# EAGLE design Nintendo DSi USB-C (EAGLE 6.2)
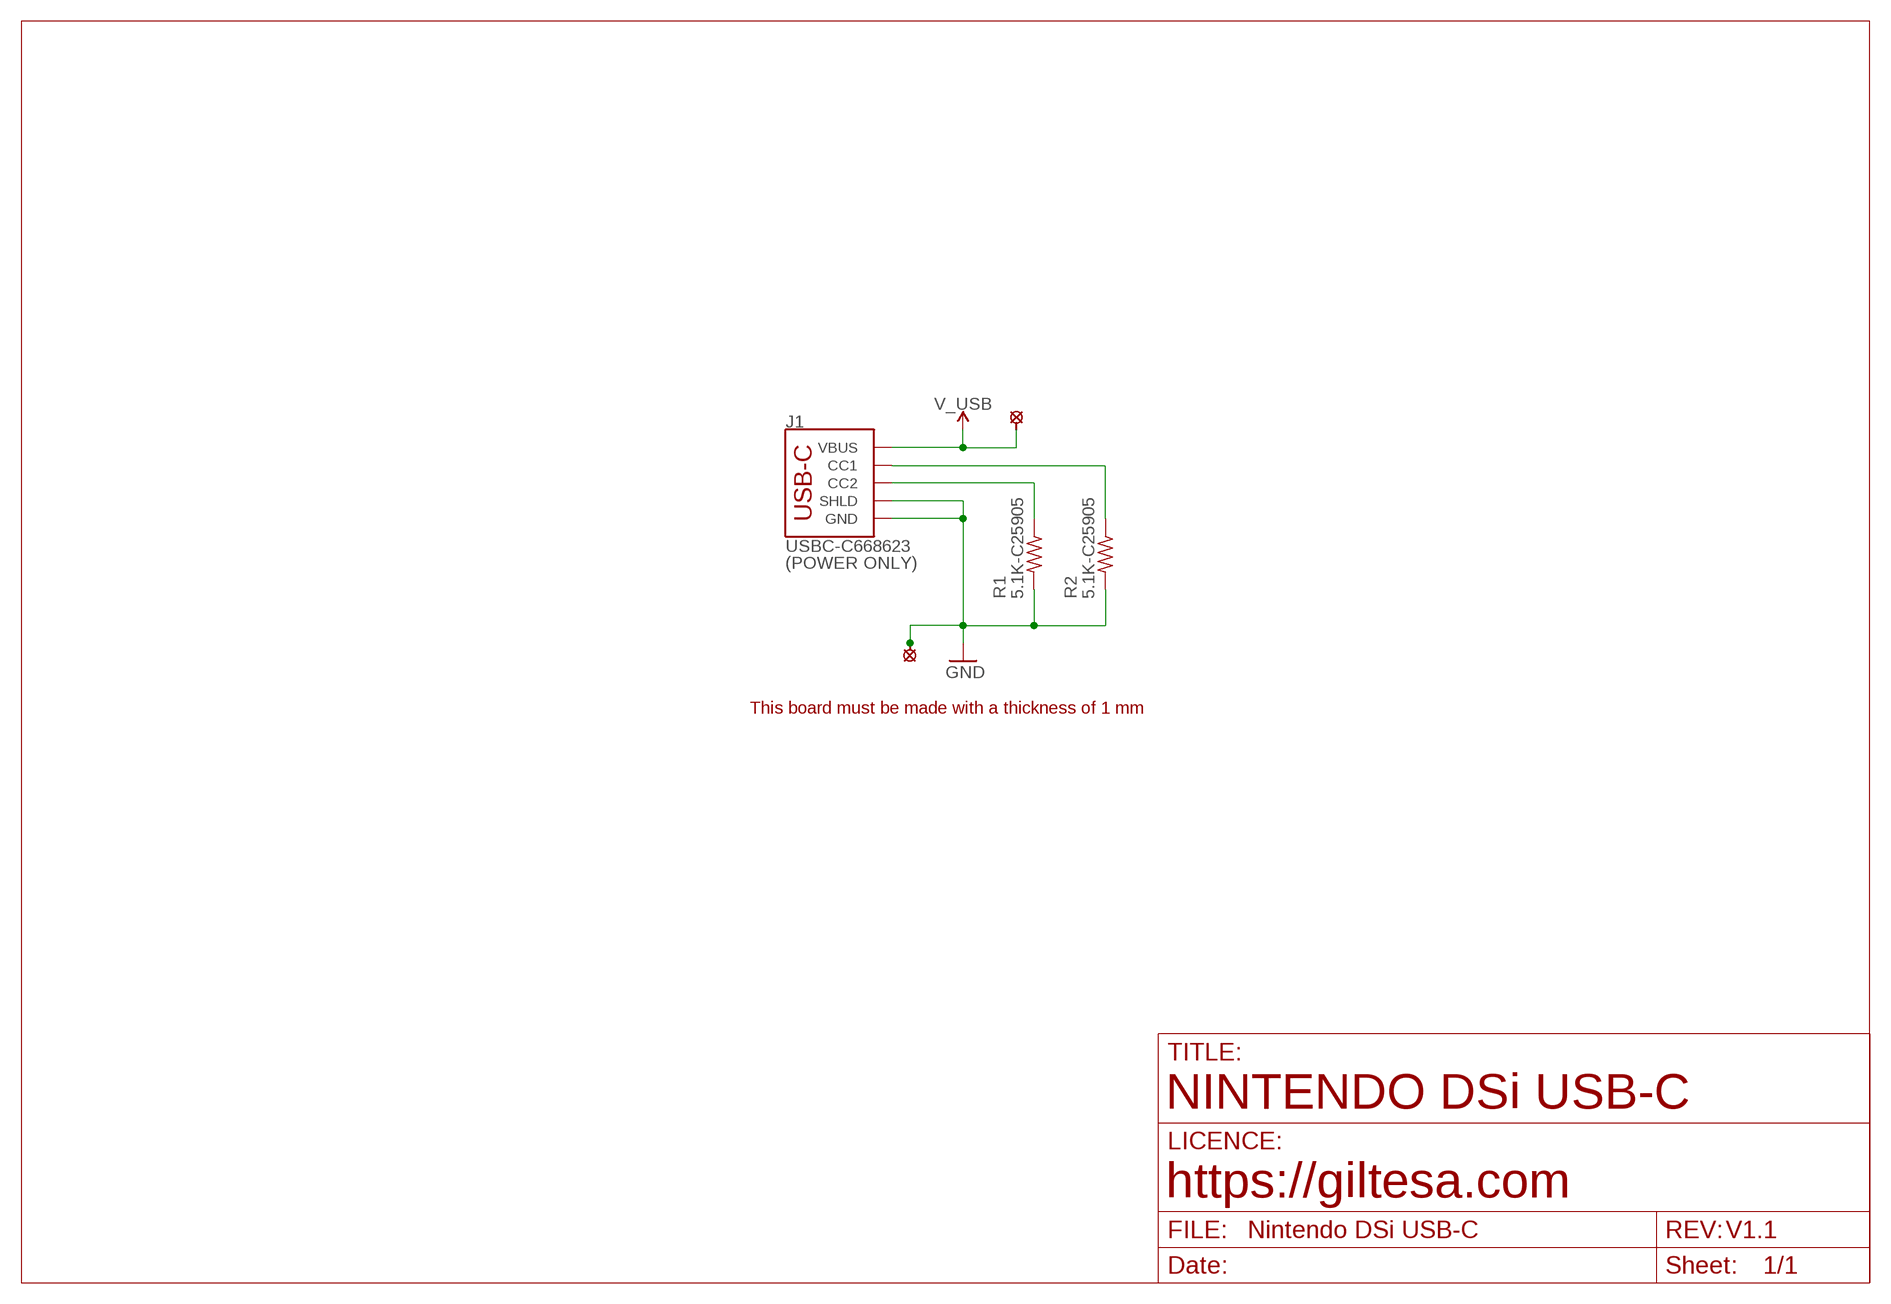
[diagram p0: schematic, sheet 1]

## Parts
J1  USBC-C668623  USB-C_6P_POWER  [USB-C_6P]
R1  5.1K-C25905  R0402  [R0402]
R2  5.1K-C25905  R0402  [R0402]
U$2  PAD_1.0H  [PAD_1.0_HALF_MASK]
U$3  PAD_1.0H  [PAD_1.0_HALF_MASK]
U$4  PAD_1.0H  [PAD_1.0_HALF_MASK]
U$5  PAD_1.0H  [PAD_1.0_HALF_MASK]

## Nets
GND: J1.A12-GND(GND) J1.B12-GND(GND) J1.SHLD1(SHLD) J1.SHLD2(SHLD) J1.SHLD3(SHLD) J1.SHLD4(SHLD) R1.2 R2.2 U$3.P$1 U$4.P$1 U$5.P$1
N$4: J1.B5(CC2) R1.1
N$13: J1.A5(CC1) R2.1
V_USB: J1.A9-VBUS(VBUS) J1.B9-VBUS(VBUS) U$2.P$1

## Notes on the sheet
- (POWER ONLY)
- This board must be made with a thickness of 1 mm
- NINTENDO DSi USB-C
- https://giltesa.com
- V1.1

## Library data of the parts
J1 = ,giltesa:USB-C_6P
R1 R2 = ,giltesa:R0402
U$2-U$5 = ,giltesa:PAD

## Net classes
1 power: width 0.61 mm, drill 0.406 mm, clearance 0.203 mm
2 gnd: width 0.305 mm, drill 0.406 mm, clearance 0.203 mm
3 power usb: width 0.508 mm, drill 0.406 mm, clearance 0.203 mm

## Board
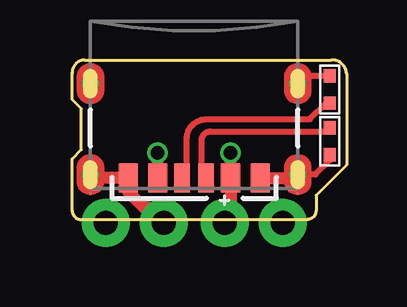
[diagram p1: board, top side]
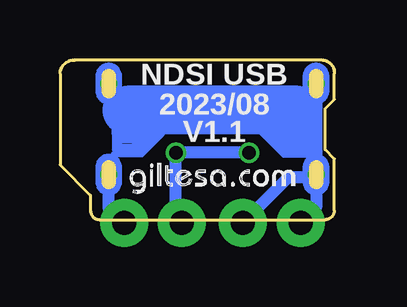
[diagram p2: board, bottom side, seen from below]

Size 11.43 x 6.67 mm. Coordinates in mm from the lower left corner, seen from the top.
Outline: 11.43,6.1 11.43,2.29 10.16,1.02 10.16,0.38 arc-90 9.78,0 0.38,0 arc-90 0,0.38 0,2.54 0.38,2.92 0.38,4.64 0,5.02 0,6.1 arc-90 0.51,6.67 10.8,6.67 arc-90 11.43,6.1
Copper layers (1*16): Top 0.035mm / dielectric 1.6mm / Bottom 0.035mm
Design rules: minimum track width 6mil, minimum drill 12mil, track to track 6mil, track to pad 6mil, pad to pad 6mil, via to via 8mil, smd to smd 0mil, copper to edge 20mil, drill to drill 10mil, minimum pad ring 6mil, minimum via ring 6mil, stop-mask expansion 0mil, vias tented up to drill 100mil, thermal gap 10mil

### Footprints (pad centres in the part's own frame; a part is rotated, then mirrored left to right if it is on the bottom)
USB-C_6P = smd 0.635 x 1.2: A5 -0.5,2.034; B5 0.5,2.034 | smd 0.8 x 1.2: A9-VBUS 1.52,2.034; A12-GND 2.75,2.034; B9-VBUS -1.52,2.034; B12-GND -2.75,2.034 | drill 0.4 pad 0.6: SHLD1 -4.318,1.9; SHLD2 4.32,1.9; SHLD3 -4.318,-1.9; SHLD4 4.32,-1.9
R0402 = smd 0.559 x 0.5: 1 -0.567,0; 2 0.567,0
PAD_1.0_HALF_MASK = drill 1 pad 2: P$1 0,0

### Placement (x,y rotation side)
J1  5.08,3.78 180 top
R1  10.73,5.43 90 top
R2  10.73,3.27 270 top
U$2  6.35,-0.13 0 top
U$3  1.4,-0.13 0 top
U$4  3.81,-0.13 0 top
U$5  8.76,-0.13 0 top
U$11  [GILTESA.COM_MASK_7MM]  8.56,1.02 0 bottom

### Tracks (layer width: path | path; a pad name or v marks a point on that pad's centre or on a via)
GND
  Top 0.254: R2.2 10.73,2.48 10.14,1.88 J1.SHLD1 9.27,1.75 | R1.2 9.72,6 J1.SHLD3
  Top 0.508: J1.SHLD2 0.89,1.75 J1.A12-GND 2.33,1.16 2.99,0.51 3.18,0.51 U$4.P$1 | J1.B12-GND 9.27,1.75
  Bottom 0.254: 0.89,2.79 1.91,2.79 2.67,3.56 1.14,3.56 1.02,3.68 1.02,2.92 | 1.02,2.92 1.78,2.92 2.29,3.43 1.14,3.43 1.14,3.05 1.78,3.05 1.78,3.17 1.91,3.3 1.27,3.3 | 9.14,3.56 7.37,3.56 8.13,2.79 9.14,2.79 J1.SHLD1 | 9.14,3.56 9.14,2.92 8.26,2.92 7.75,3.43 9.02,3.43 9.02,3.05 8.38,3.05 8.13,3.3 8.89,3.3 | 9.14,3.56 9.14,3.94 8.64,4.57 | J1.SHLD2 1.02,2.14 1.02,2.92 | 9.4,5.08 J1.SHLD3
  Bottom 0.508: J1.SHLD2 J1.SHLD4 0.76,4.96 1.52,4.57 | J1.SHLD2 0.76,0.51 U$3.P$1 | U$5.P$1 9.4,0.51 J1.SHLD1 | 8.64,4.57 9.4,5.08 | J1.SHLD2 0.86,1.78 1.91,1.78 U$4.P$1
  Bottom 2.032: 1.52,4.57 8.64,4.57
N$3
  Bottom 0.127: 2.03,2.67 2.16,2.67 3.05,3.56 | 2.03,2.67 1.91,2.67 | 1.91,2.67 1.02,2.67 | 2.03,2.67 2.92,3.56 | 1.91,2.67 2.79,3.56
N$4
  Top 0.254: J1.B5 4.58,1.91 4.77,2.03 4.77,3.37 arc-90 5.59,4.19 9.91,4.19 10.58,4.86 R1.1
N$5
  Bottom 0.127: 9.02,2.67 8.13,2.67 7.24,3.56 | 9.02,2.67 9.14,2.67 | 7.11,3.56 8,2.67 9.02,2.67
N$13
  Top 0.254: J1.A5 5.58,1.79 5.39,1.91 5.39,3.3 arc-90 5.77,3.68 10.58,3.68 R2.1
V_USB  (via drill 0.56)
  Top 0.508: v6.6,2.79 J1.B9-VBUS 6.6,0.12 U$2.P$1 | J1.A9-VBUS v3.56,2.79
  Bottom 0.508: U$2.P$1 6.6,0.13 v6.6,2.79 v3.56,2.79

### Text on the board
bPlace: NDSI USB | 2023/08 | V1.1